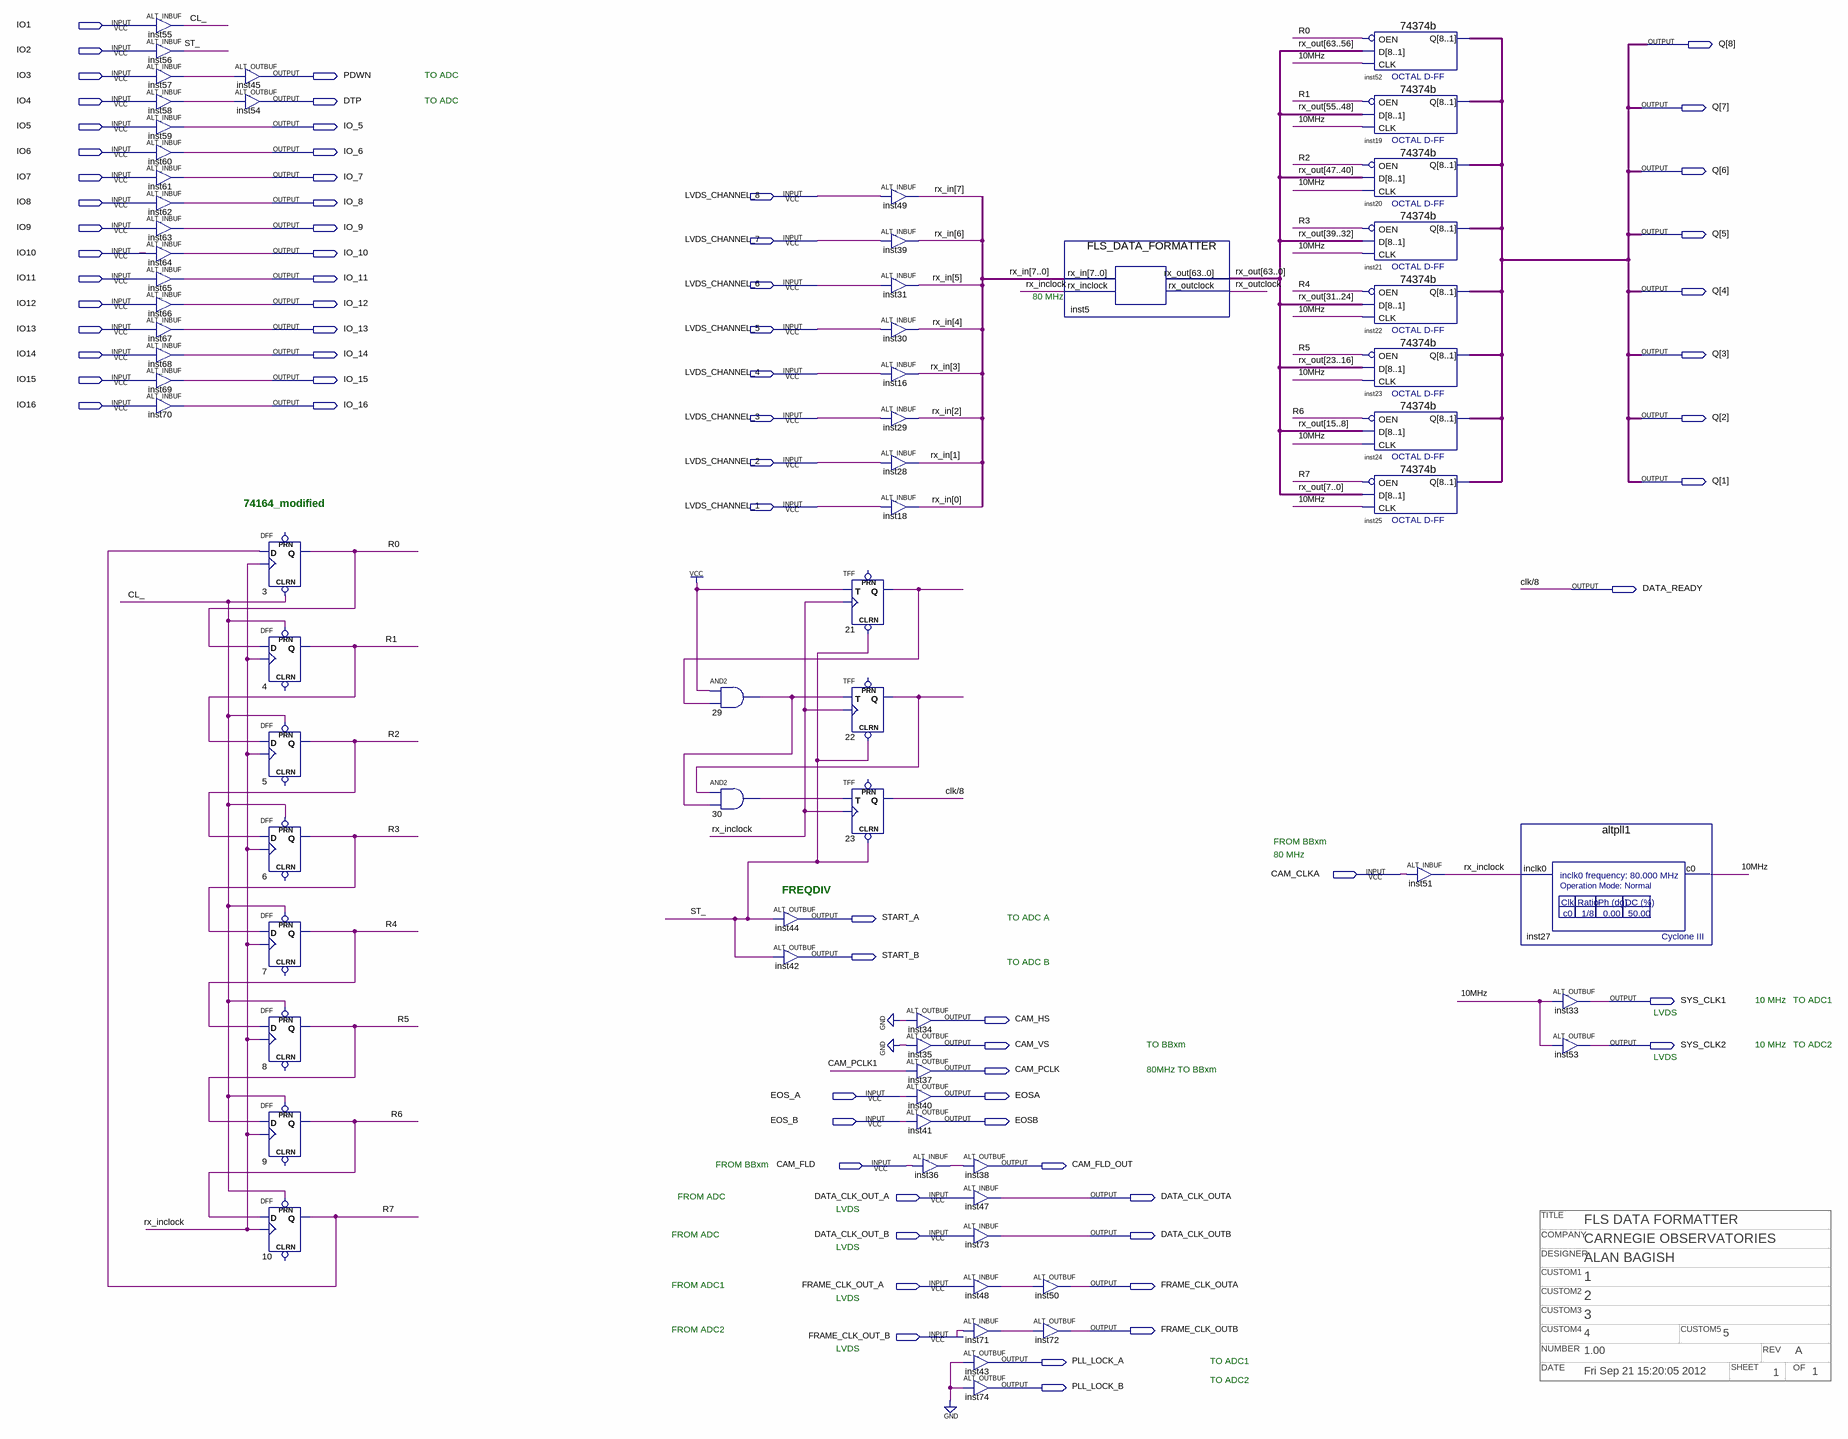
[diagram p0: schematic sheet]
// Quartus schematic 64bitmux.bdf as structural Verilog: 69 symbols, 71 pins
// Title block: TITLE: FLS DATA FORMATTER; COMPANY: CARNEGIE OBSERVATORIES; DESIGNER: ALAN BAGISH; NUMBER: 1.00; REV: A; DATE: Fri Sep 21 15:20:05 2012; SHEET: 1; OF: 1; CUSTOM1: 1; CUSTOM2: 2; CUSTOM3: 3; CUSTOM4: 4; CUSTOM5: 5
module \64bitmux  (
  input  IO1,
  input  IO2,
  input  IO3,
  input  IO4,
  input  IO5,
  input  IO6,
  input  IO7,
  input  LVDS_CHANNEL_8,
  input  IO8,
  input  IO9,
  input  LVDS_CHANNEL_7,
  input  IO10,
  input  IO11,
  input  LVDS_CHANNEL_6,
  input  IO12,
  input  IO13,
  input  LVDS_CHANNEL_5,
  input  IO14,
  input  LVDS_CHANNEL_4,
  input  IO15,
  input  IO16,
  input  LVDS_CHANNEL_3,
  input  LVDS_CHANNEL_2,
  input  LVDS_CHANNEL_1,
  input  CAM_CLKA,
  input  EOS_A,
  input  EOS_B,
  input  CAM_FLD,
  input  DATA_CLK_OUT_A,
  input  DATA_CLK_OUT_B,
  input  FRAME_CLK_OUT_A,
  input  FRAME_CLK_OUT_B,
  output [8:1] Q,
  output PDWN,
  output DTP,
  output IO_5,
  output IO_6,
  output IO_7,
  output IO_8,
  output IO_9,
  output IO_10,
  output IO_11,
  output IO_12,
  output IO_13,
  output IO_14,
  output IO_15,
  output IO_16,
  output DATA_READY,
  output START_A,
  output START_B,
  output SYS_CLK1,
  output CAM_HS,
  output CAM_VS,
  output SYS_CLK2,
  output CAM_PCLK,
  output EOSA,
  output EOSB,
  output CAM_FLD_OUT,
  output DATA_CLK_OUTA,
  output DATA_CLK_OUTB,
  output FRAME_CLK_OUTA,
  output FRAME_CLK_OUTB,
  output PLL_LOCK_A,
  output PLL_LOCK_B
);

  wire \10MHz , CAM_PCLK1, CL_, inst36_o, inst48_o, inst57_o, inst58_o, inst71_o, n21_q, n22_q, n29_out,
       n30_out, R0, R1, R2, R3, R4, R5, R6, R7, rx_inclock, rx_outclock, ST_;
  wire [7:0] inst52_q, rx_in;
  wire [63:0] rx_out;

  ALT_INBUF inst55 (.i(IO1), .o(CL_));
  ALT_INBUF inst56 (.i(IO2), .o(ST_));
  ALT_INBUF inst57 (.i(IO3), .o(inst57_o));
  ALT_INBUF inst58 (.i(IO4), .o(inst58_o));
  ALT_INBUF inst59 (.i(IO5), .o(IO_5));
  ALT_INBUF inst60 (.i(IO6), .o(IO_6));
  ALT_INBUF inst61 (.i(IO7), .o(IO_7));
  ALT_INBUF inst62 (.i(IO8), .o(IO_8));
  ALT_INBUF inst63 (.i(IO9), .o(IO_9));
  ALT_INBUF inst64 (.i(IO10), .o(IO_10));
  ALT_INBUF inst65 (.i(IO11), .o(IO_11));
  ALT_INBUF inst66 (.i(IO12), .o(IO_12));
  ALT_INBUF inst67 (.i(IO13), .o(IO_13));
  ALT_INBUF inst68 (.i(IO14), .o(IO_14));
  ALT_INBUF inst69 (.i(IO15), .o(IO_15));
  ALT_INBUF inst70 (.i(IO16), .o(IO_16));
  ALT_OUTBUF inst45 (.i(inst57_o), .o(PDWN));
  ALT_OUTBUF inst54 (.i(inst58_o), .o(DTP));
  DFF u_3 (.CLRN(CL_), .CLK(rx_inclock), .D(R7), .Q(R0));  // open: PRN
  DFF u_4 (.CLK(rx_inclock), .D(R0), .PRN(CL_), .Q(R1));  // open: CLRN
  DFF u_5 (.CLK(rx_inclock), .D(R1), .PRN(CL_), .Q(R2));  // open: CLRN
  DFF u_6 (.CLK(rx_inclock), .D(R2), .PRN(CL_), .Q(R3));  // open: CLRN
  DFF u_7 (.CLK(rx_inclock), .D(R3), .PRN(CL_), .Q(R4));  // open: CLRN
  DFF u_8 (.CLK(rx_inclock), .D(R4), .PRN(CL_), .Q(R5));  // open: CLRN
  DFF u_9 (.CLK(rx_inclock), .D(R5), .PRN(CL_), .Q(R6));  // open: CLRN
  DFF u_10 (.CLK(rx_inclock), .D(R6), .PRN(CL_), .Q(R7));  // open: CLRN
  and u_29 (n29_out, 1'b1, n21_q);
  and u_30 (n30_out, n22_q, n29_out);
  ALT_OUTBUF inst44 (.i(ST_), .o(START_A));
  ALT_OUTBUF inst42 (.i(ST_), .o(START_B));
  TFF u_21 (.CLRN(ST_), .T(1'b1), .CLK(rx_inclock), .Q(n21_q));  // open: PRN
  TFF u_22 (.CLRN(ST_), .T(n29_out), .CLK(rx_inclock), .Q(n22_q));  // open: PRN
  TFF u_23 (.CLRN(ST_), .T(n30_out), .CLK(rx_inclock), .Q(DATA_READY));  // open: PRN
  ALT_INBUF inst49 (.i(LVDS_CHANNEL_8), .o(rx_in[7]));
  ALT_INBUF inst39 (.i(LVDS_CHANNEL_7), .o(rx_in[6]));
  ALT_INBUF inst31 (.i(LVDS_CHANNEL_6), .o(rx_in[5]));
  ALT_INBUF inst30 (.i(LVDS_CHANNEL_5), .o(rx_in[4]));
  ALT_INBUF inst16 (.i(LVDS_CHANNEL_4), .o(rx_in[3]));
  ALT_INBUF inst29 (.i(LVDS_CHANNEL_3), .o(rx_in[2]));
  ALT_INBUF inst28 (.i(LVDS_CHANNEL_2), .o(rx_in[1]));
  ALT_INBUF inst18 (.i(LVDS_CHANNEL_1), .o(rx_in[0]));
  ALT_OUTBUF inst34 (.i(1'b0), .o(CAM_HS));
  ALT_OUTBUF inst35 (.i(1'b0), .o(CAM_VS));
  ALT_OUTBUF inst37 (.i(CAM_PCLK1), .o(CAM_PCLK));
  ALT_OUTBUF inst40 (.i(EOS_A), .o(EOSA));
  ALT_OUTBUF inst41 (.i(EOS_B), .o(EOSB));
  ALT_INBUF inst36 (.i(CAM_FLD), .o(inst36_o));
  ALT_OUTBUF inst38 (.i(inst36_o), .o(CAM_FLD_OUT));
  ALT_INBUF inst47 (.i(DATA_CLK_OUT_A), .o(DATA_CLK_OUTA));
  ALT_INBUF inst73 (.i(DATA_CLK_OUT_B), .o(DATA_CLK_OUTB));
  ALT_INBUF inst48 (.i(FRAME_CLK_OUT_A), .o(inst48_o));
  ALT_INBUF inst71 (.i(FRAME_CLK_OUT_B), .o(inst71_o));
  ALT_OUTBUF inst43 (.i(1'b0), .o(PLL_LOCK_A));
  ALT_OUTBUF inst74 (.i(1'b0), .o(PLL_LOCK_B));
  FLS_DATA_FORMATTER inst5 (.rx_in(rx_in), .rx_inclock(rx_inclock), .rx_out(rx_out), .rx_outclock(rx_outclock));
  ALT_OUTBUF inst50 (.i(inst48_o), .o(FRAME_CLK_OUTA));
  ALT_OUTBUF inst72 (.i(inst71_o), .o(FRAME_CLK_OUTB));
  \74374b  inst52 (.D(rx_out[63:56]), .OEN(R0), .CLK(\10MHz ), .Q(inst52_q));
  \74374b  inst19 (.D(rx_out[55:48]), .OEN(R1), .CLK(\10MHz ), .Q(inst52_q));
  \74374b  inst20 (.D(rx_out[47:40]), .OEN(R2), .CLK(\10MHz ), .Q(inst52_q));
  \74374b  inst21 (.D(rx_out[39:32]), .OEN(R3), .CLK(\10MHz ), .Q(inst52_q));
  \74374b  inst22 (.D(rx_out[31:24]), .OEN(R4), .CLK(\10MHz ), .Q(inst52_q));
  \74374b  inst23 (.D(rx_out[23:16]), .OEN(R5), .CLK(\10MHz ), .Q(inst52_q));
  \74374b  inst24 (.D(rx_out[15:8]), .OEN(R6), .CLK(\10MHz ), .Q(inst52_q));
  \74374b  inst25 (.D(rx_out[7:0]), .OEN(R7), .CLK(\10MHz ), .Q(inst52_q));
  ALT_INBUF inst51 (.i(CAM_CLKA), .o(rx_inclock));
  altpll1 inst27 (.inclk0(rx_inclock), .c0(\10MHz ));
  ALT_OUTBUF inst33 (.i(\10MHz ), .o(SYS_CLK1));
  ALT_OUTBUF inst53 (.i(\10MHz ), .o(SYS_CLK2));

  // Other names for the same wires on the sheet: clk/8 = DATA_READY

  // Notes on the sheet:
  //   TO ADC
  //   TO ADC
  //   80 MHz
  //   74164_modified
  //   FROM BBxm
  //   80 MHz
  //   FREQDIV
  //   TO ADC A
  //   TO ADC B
  //   10 MHz
  //   TO ADC1
  //   LVDS
  //   TO BBxm
  //   10 MHz
  //   TO ADC2
  //   LVDS
  //   80MHz TO BBxm
  //   FROM BBxm
  //   FROM ADC
  //   LVDS
  //   FROM ADC
  //   LVDS
  //   FROM ADC1
  //   LVDS
  //   FROM ADC2
  //   LVDS
  //   TO ADC1
  //   TO ADC2
endmodule
